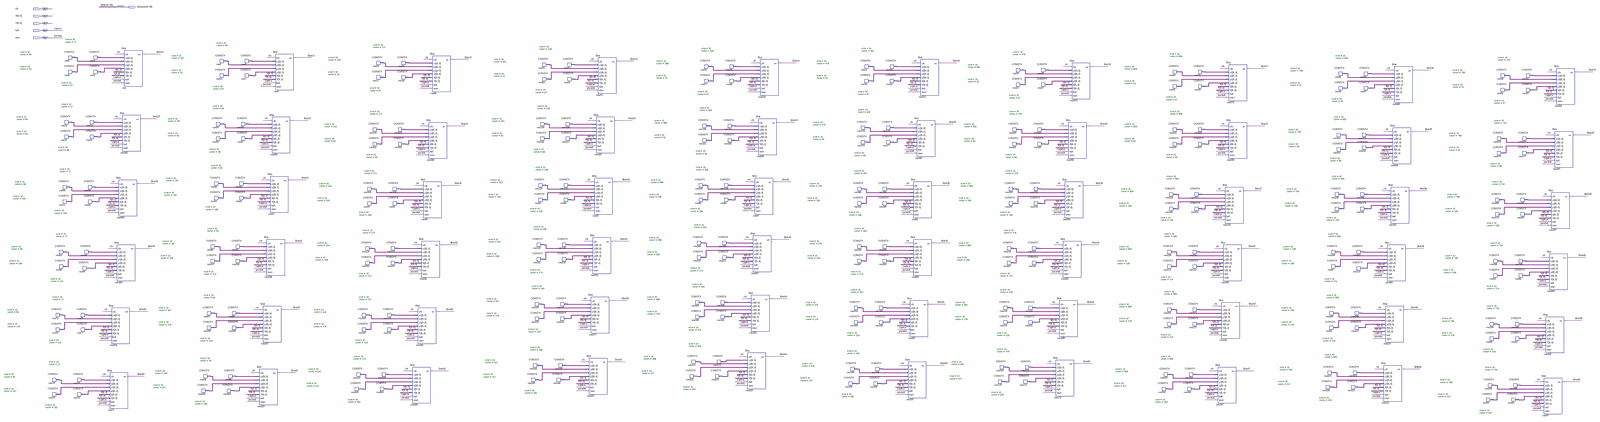
[diagram p0: schematic sheet, whole]
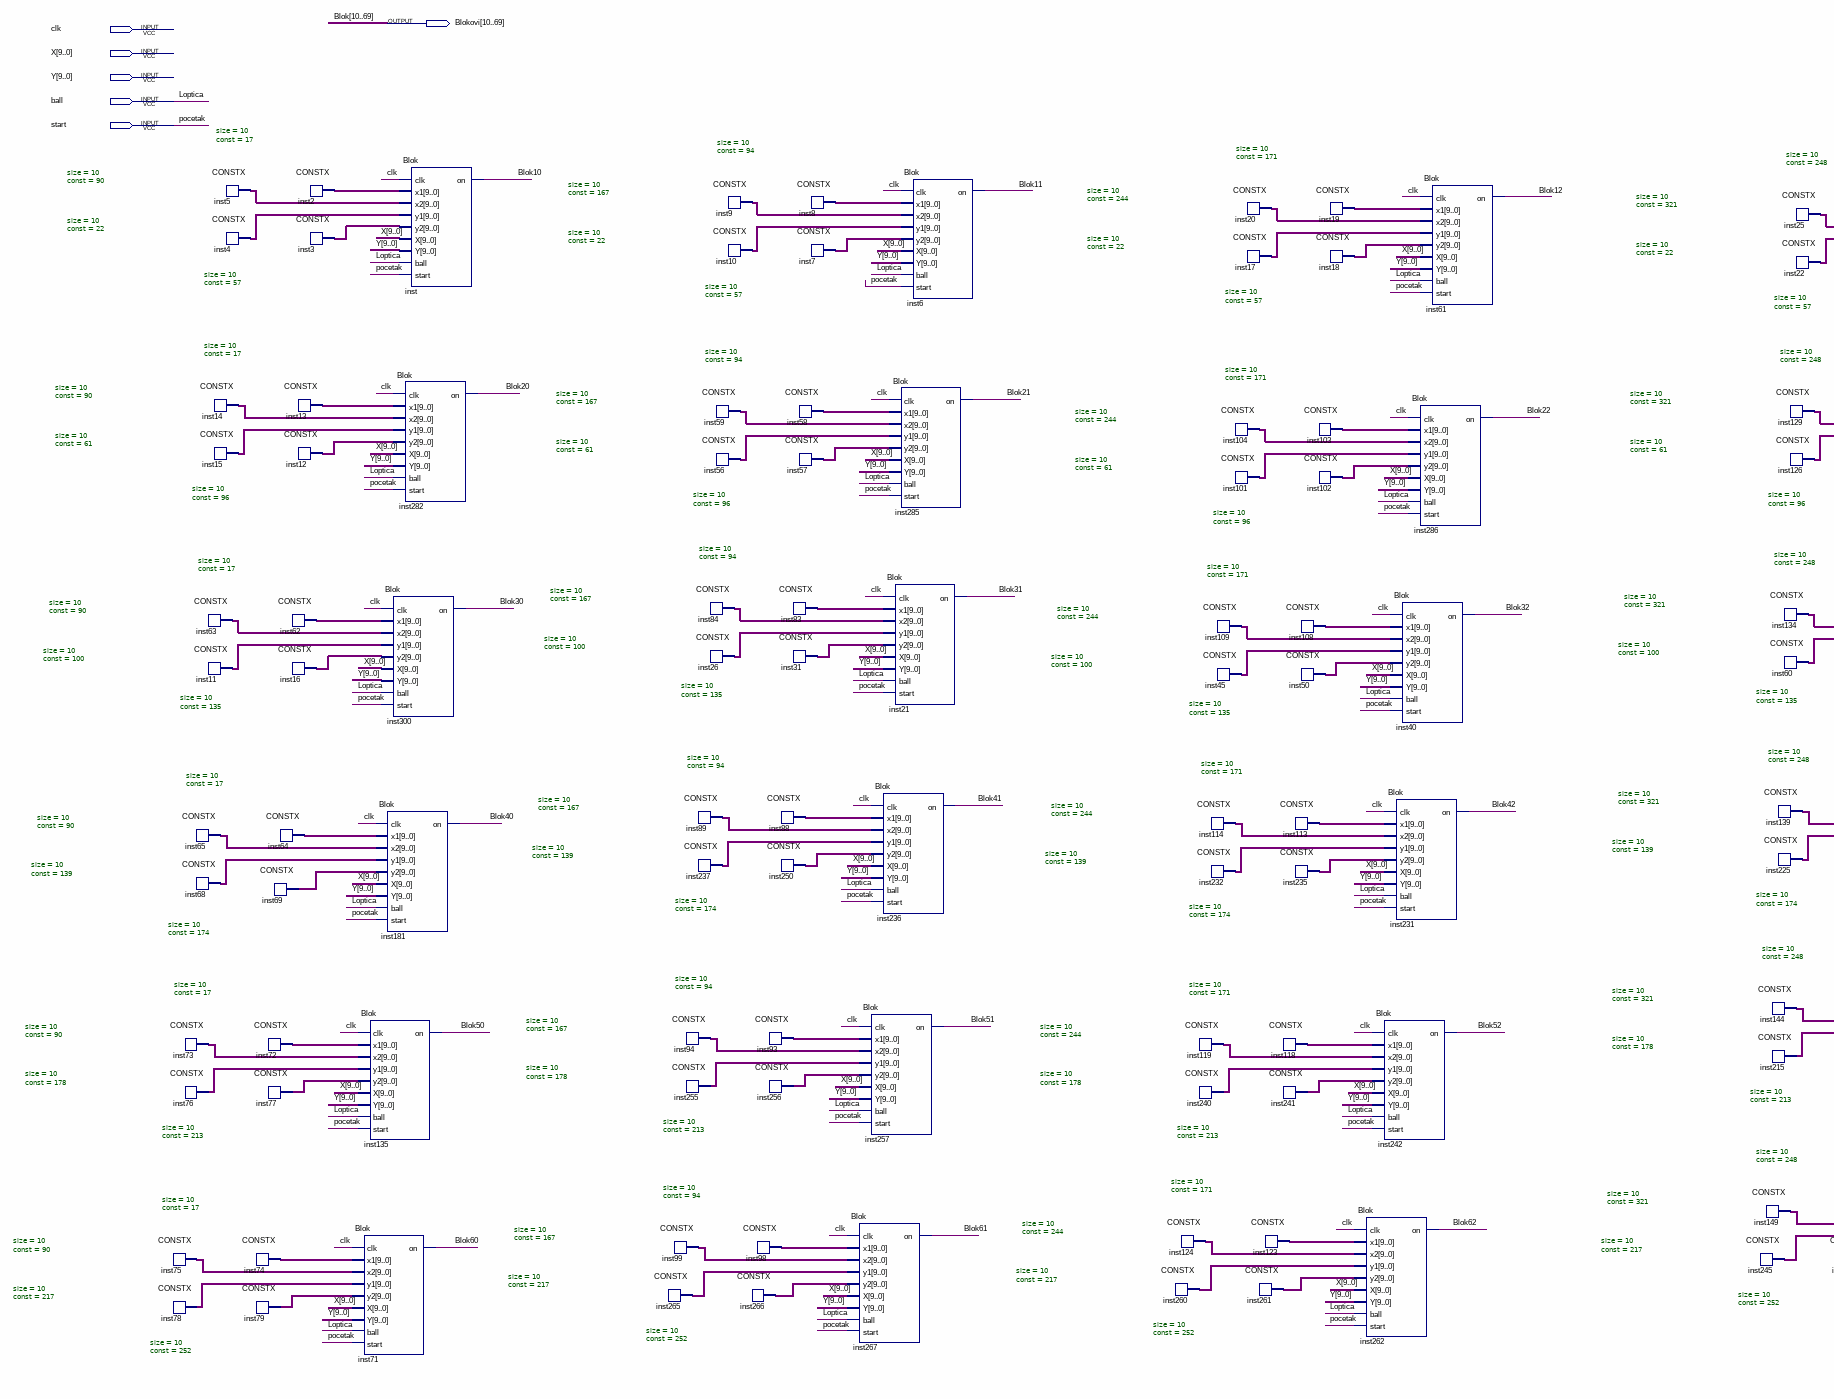
[diagram p1: schematic sheet, left part]
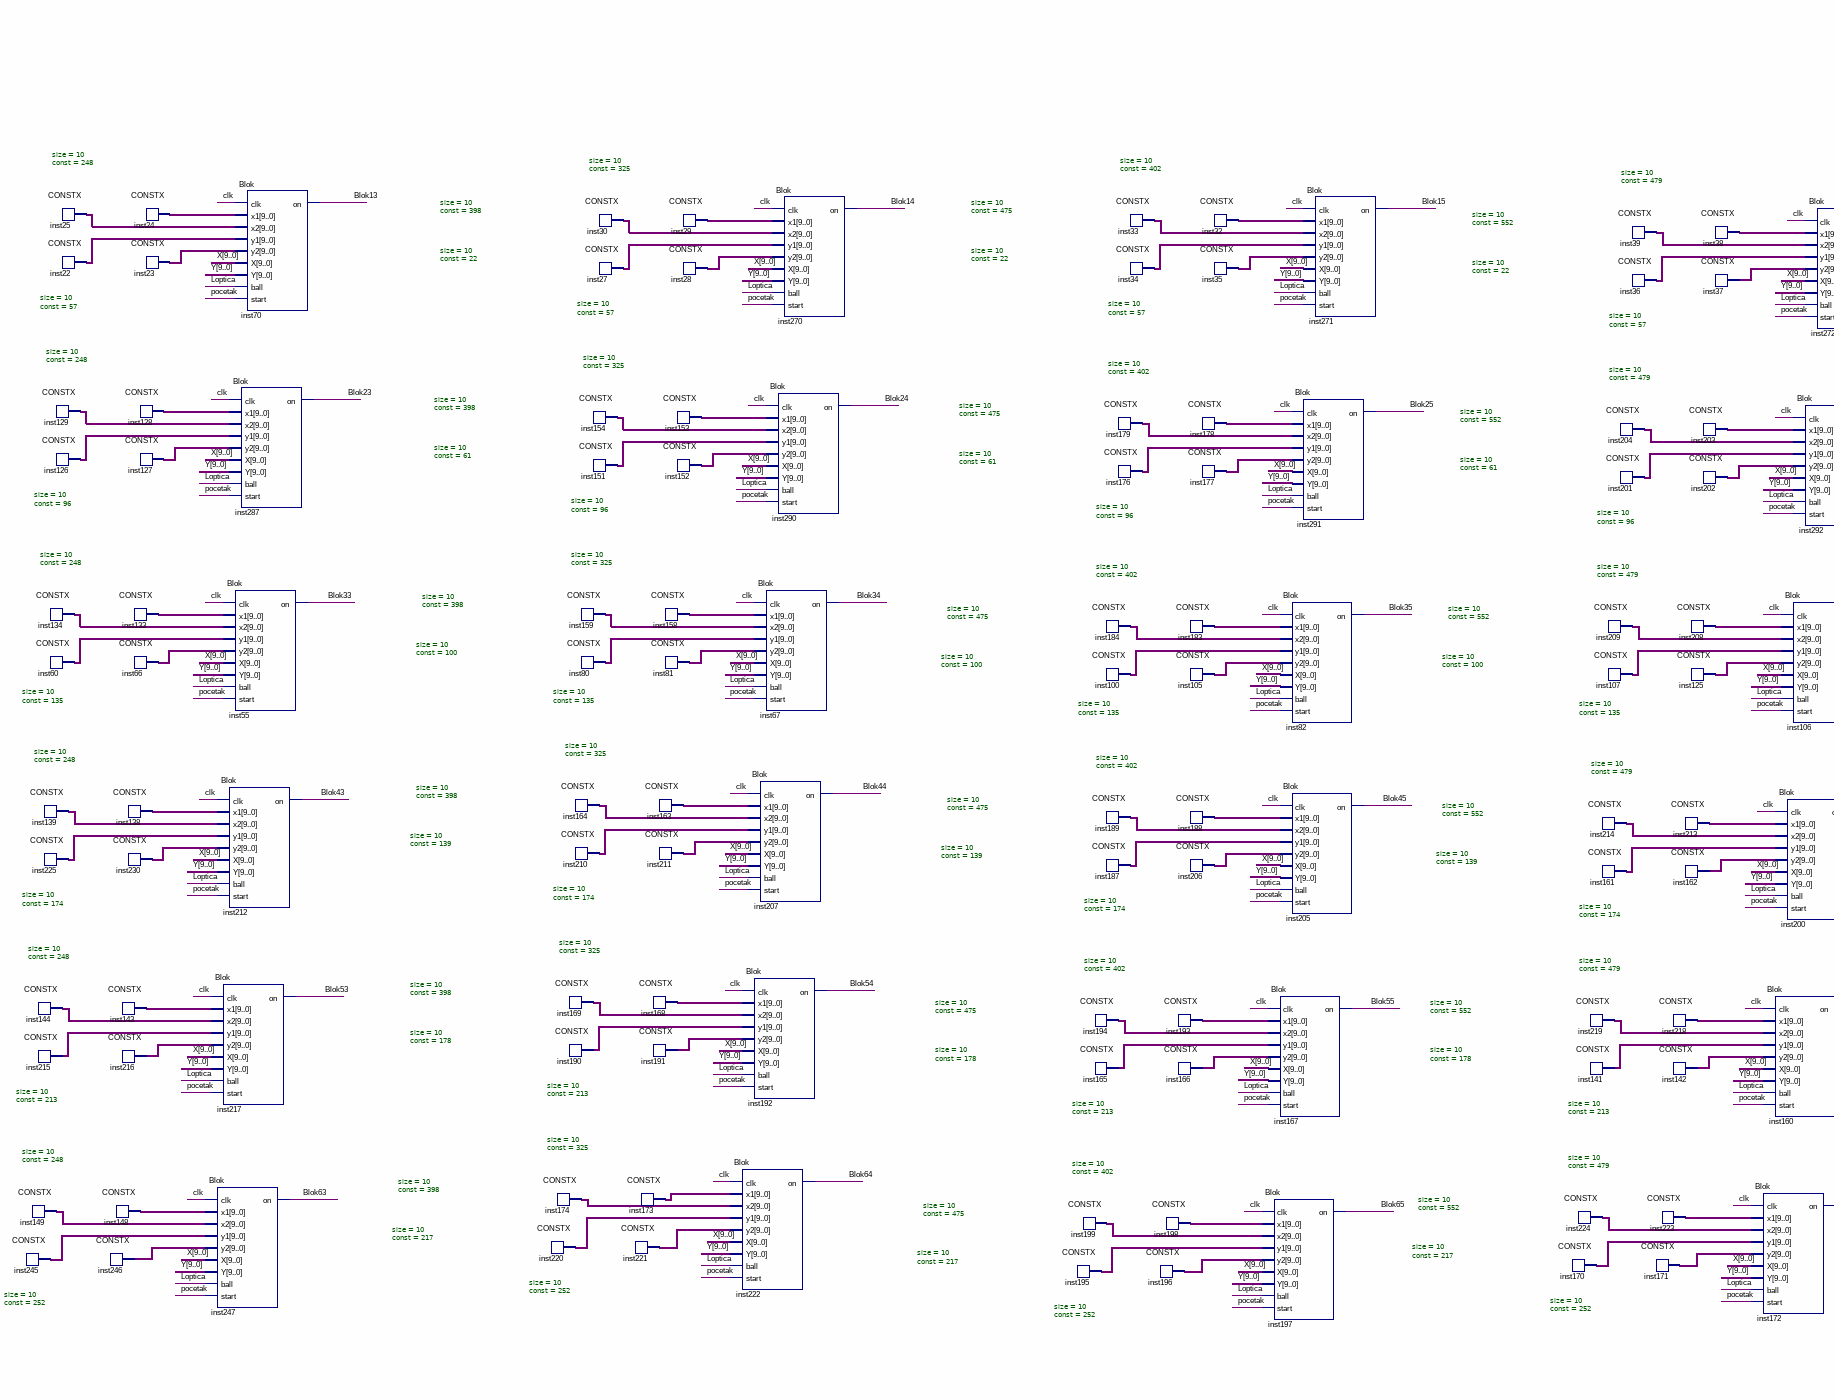
[diagram p2: schematic sheet, centre part]
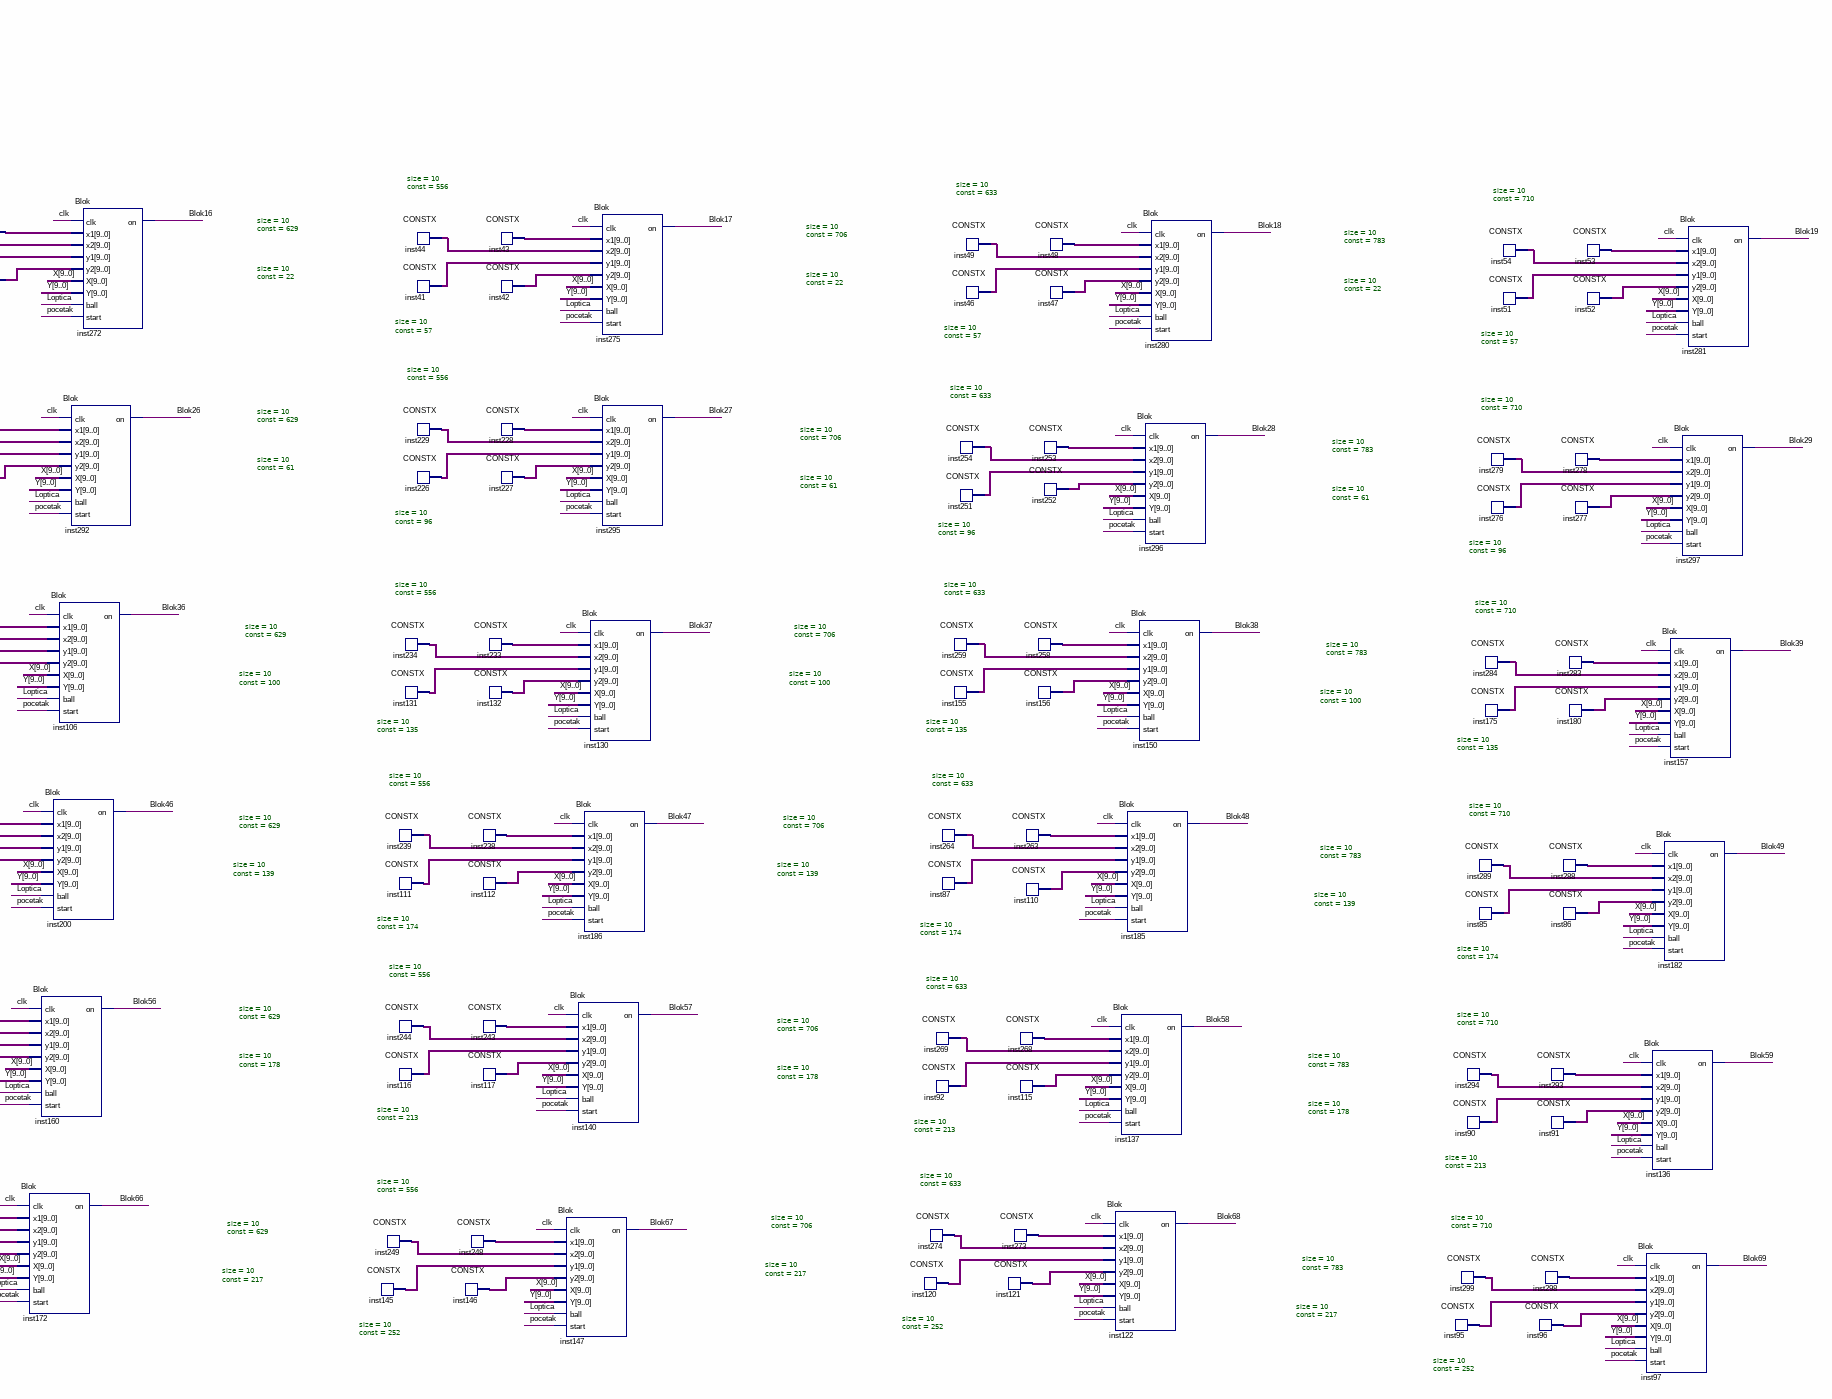
[diagram p3: schematic sheet, right part]
// Quartus schematic Blokovi.bdf as structural Verilog: 300 symbols, 6 pins
module Blokovi (
  input  clk,
  input  [9:0] X,
  input  [9:0] Y,
  input  ball,
  input  start,
  output [10:69] Blokovi
);

  wire [9:0] inst2_data, inst3_data, inst4_data, inst5_data, inst7_data, inst8_data, inst9_data, inst10_data,
       inst11_data, inst12_data, inst13_data, inst14_data, inst15_data, inst16_data, inst17_data,
       inst18_data, inst19_data, inst20_data, inst22_data, inst23_data, inst24_data, inst25_data,
       inst26_data, inst27_data, inst28_data, inst29_data, inst30_data, inst31_data, inst32_data,
       inst33_data, inst34_data, inst35_data, inst36_data, inst37_data, inst38_data, inst39_data,
       inst41_data, inst42_data, inst43_data, inst44_data, inst45_data, inst46_data, inst47_data,
       inst48_data, inst49_data, inst50_data, inst51_data, inst52_data, inst53_data, inst54_data,
       inst56_data, inst57_data, inst58_data, inst59_data, inst60_data, inst62_data, inst63_data,
       inst64_data, inst65_data, inst66_data, inst68_data, inst69_data, inst72_data, inst73_data,
       inst74_data, inst75_data, inst76_data, inst77_data, inst78_data, inst79_data, inst80_data,
       inst81_data, inst83_data, inst84_data, inst85_data, inst86_data, inst87_data, inst88_data,
       inst89_data, inst90_data, inst91_data, inst92_data, inst93_data, inst94_data, inst95_data,
       inst96_data, inst98_data, inst99_data, inst100_data, inst101_data, inst102_data, inst103_data,
       inst104_data, inst105_data, inst107_data, inst108_data, inst109_data, inst110_data, inst111_data,
       inst112_data, inst113_data, inst114_data, inst115_data, inst116_data, inst117_data, inst118_data,
       inst119_data, inst120_data, inst121_data, inst123_data, inst124_data, inst125_data, inst126_data,
       inst127_data, inst128_data, inst129_data, inst131_data, inst132_data, inst133_data, inst134_data,
       inst138_data, inst139_data, inst141_data, inst142_data, inst143_data, inst144_data, inst145_data,
       inst146_data, inst148_data, inst149_data, inst151_data, inst152_data, inst153_data, inst154_data,
       inst155_data, inst156_data, inst158_data, inst159_data, inst161_data, inst162_data, inst163_data,
       inst164_data, inst165_data, inst166_data, inst168_data, inst169_data, inst170_data, inst171_data,
       inst173_data, inst174_data, inst175_data, inst176_data, inst177_data, inst178_data, inst179_data,
       inst180_data, inst183_data, inst184_data, inst187_data, inst188_data, inst189_data, inst190_data,
       inst191_data, inst193_data, inst194_data, inst195_data, inst196_data, inst198_data, inst199_data,
       inst201_data, inst202_data, inst203_data, inst204_data, inst206_data, inst208_data, inst209_data,
       inst210_data, inst211_data, inst213_data, inst214_data, inst215_data, inst216_data, inst218_data,
       inst219_data, inst220_data, inst221_data, inst223_data, inst224_data, inst225_data, inst226_data,
       inst227_data, inst228_data, inst229_data, inst230_data, inst232_data, inst233_data, inst234_data,
       inst235_data, inst237_data, inst238_data, inst239_data, inst240_data, inst241_data, inst243_data,
       inst244_data, inst245_data, inst246_data, inst248_data, inst249_data, inst250_data, inst251_data,
       inst252_data, inst253_data, inst254_data, inst255_data, inst256_data, inst258_data, inst259_data,
       inst260_data, inst261_data, inst263_data, inst264_data, inst265_data, inst266_data, inst268_data,
       inst269_data, inst273_data, inst274_data, inst276_data, inst277_data, inst278_data, inst279_data,
       inst283_data, inst284_data, inst288_data, inst289_data, inst293_data, inst294_data, inst298_data,
       inst299_data;

  CONSTX #(.size(10), .\const (90)) inst65 (.data(inst65_data));
  CONSTX #(.size(10), .\const (139)) inst68 (.data(inst68_data));
  CONSTX #(.size(10), .\const (90)) inst73 (.data(inst73_data));
  CONSTX #(.size(10), .\const (178)) inst76 (.data(inst76_data));
  CONSTX #(.size(10), .\const (90)) inst75 (.data(inst75_data));
  CONSTX #(.size(10), .\const (217)) inst78 (.data(inst78_data));
  CONSTX #(.size(10), .\const (90)) inst5 (.data(inst5_data));
  CONSTX #(.size(10), .\const (22)) inst4 (.data(inst4_data));
  CONSTX #(.size(10), .\const (90)) inst14 (.data(inst14_data));
  CONSTX #(.size(10), .\const (61)) inst15 (.data(inst15_data));
  CONSTX #(.size(10), .\const (90)) inst63 (.data(inst63_data));
  CONSTX #(.size(10), .\const (100)) inst11 (.data(inst11_data));
  CONSTX #(.size(10), .\const (17)) inst13 (.data(inst13_data));
  CONSTX #(.size(10), .\const (96)) inst12 (.data(inst12_data));
  CONSTX #(.size(10), .\const (17)) inst62 (.data(inst62_data));
  CONSTX #(.size(10), .\const (135)) inst16 (.data(inst16_data));
  CONSTX #(.size(10), .\const (17)) inst64 (.data(inst64_data));
  CONSTX #(.size(10), .\const (174)) inst69 (.data(inst69_data));
  CONSTX #(.size(10), .\const (17)) inst72 (.data(inst72_data));
  CONSTX #(.size(10), .\const (213)) inst77 (.data(inst77_data));
  CONSTX #(.size(10), .\const (17)) inst74 (.data(inst74_data));
  CONSTX #(.size(10), .\const (252)) inst79 (.data(inst79_data));
  CONSTX #(.size(10), .\const (17)) inst2 (.data(inst2_data));
  CONSTX #(.size(10), .\const (57)) inst3 (.data(inst3_data));
  Blok inst181 (
    .clk(clk), .x1(inst64_data), .x2(inst65_data), .y1(inst68_data), .y2(inst69_data), .X(X), .Y(Y),
    .ball(ball), .start(start), .on(Blokovi[40]));
  Blok inst135 (
    .clk(clk), .x1(inst72_data), .x2(inst73_data), .y1(inst76_data), .y2(inst77_data), .X(X), .Y(Y),
    .ball(ball), .start(start), .on(Blokovi[50]));
  Blok inst71 (
    .clk(clk), .x1(inst74_data), .x2(inst75_data), .y1(inst78_data), .y2(inst79_data), .X(X), .Y(Y),
    .ball(ball), .start(start), .on(Blokovi[60]));
  Blok inst (
    .clk(clk), .x1(inst2_data), .x2(inst5_data), .y1(inst4_data), .y2(inst3_data), .X(X), .Y(Y), .ball(ball),
    .start(start), .on(Blokovi[10]));
  Blok inst282 (
    .clk(clk), .x1(inst13_data), .x2(inst14_data), .y1(inst15_data), .y2(inst12_data), .X(X), .Y(Y),
    .ball(ball), .start(start), .on(Blokovi[20]));
  Blok inst300 (
    .clk(clk), .x1(inst62_data), .x2(inst63_data), .y1(inst11_data), .y2(inst16_data), .X(X), .Y(Y),
    .ball(ball), .start(start), .on(Blokovi[30]));
  CONSTX #(.size(10), .\const (167)) inst99 (.data(inst99_data));
  CONSTX #(.size(10), .\const (217)) inst265 (.data(inst265_data));
  CONSTX #(.size(10), .\const (167)) inst9 (.data(inst9_data));
  CONSTX #(.size(10), .\const (22)) inst10 (.data(inst10_data));
  CONSTX #(.size(10), .\const (167)) inst59 (.data(inst59_data));
  CONSTX #(.size(10), .\const (61)) inst56 (.data(inst56_data));
  CONSTX #(.size(10), .\const (167)) inst84 (.data(inst84_data));
  CONSTX #(.size(10), .\const (100)) inst26 (.data(inst26_data));
  CONSTX #(.size(10), .\const (167)) inst89 (.data(inst89_data));
  CONSTX #(.size(10), .\const (139)) inst237 (.data(inst237_data));
  CONSTX #(.size(10), .\const (167)) inst94 (.data(inst94_data));
  CONSTX #(.size(10), .\const (178)) inst255 (.data(inst255_data));
  CONSTX #(.size(10), .\const (94)) inst93 (.data(inst93_data));
  CONSTX #(.size(10), .\const (213)) inst256 (.data(inst256_data));
  CONSTX #(.size(10), .\const (94)) inst98 (.data(inst98_data));
  CONSTX #(.size(10), .\const (252)) inst266 (.data(inst266_data));
  CONSTX #(.size(10), .\const (94)) inst8 (.data(inst8_data));
  CONSTX #(.size(10), .\const (57)) inst7 (.data(inst7_data));
  CONSTX #(.size(10), .\const (94)) inst58 (.data(inst58_data));
  CONSTX #(.size(10), .\const (96)) inst57 (.data(inst57_data));
  CONSTX #(.size(10), .\const (94)) inst83 (.data(inst83_data));
  CONSTX #(.size(10), .\const (135)) inst31 (.data(inst31_data));
  CONSTX #(.size(10), .\const (94)) inst88 (.data(inst88_data));
  CONSTX #(.size(10), .\const (174)) inst250 (.data(inst250_data));
  Blok inst267 (
    .clk(clk), .x1(inst98_data), .x2(inst99_data), .y1(inst265_data), .y2(inst266_data), .X(X), .Y(Y),
    .ball(ball), .start(start), .on(Blokovi[61]));
  Blok inst6 (
    .clk(clk), .x1(inst8_data), .x2(inst9_data), .y1(inst10_data), .y2(inst7_data), .X(X), .Y(Y),
    .ball(ball), .start(start), .on(Blokovi[11]));
  Blok inst285 (
    .clk(clk), .x1(inst58_data), .x2(inst59_data), .y1(inst56_data), .y2(inst57_data), .X(X), .Y(Y),
    .ball(ball), .start(start), .on(Blokovi[21]));
  Blok inst21 (
    .clk(clk), .x1(inst83_data), .x2(inst84_data), .y1(inst26_data), .y2(inst31_data), .X(X), .Y(Y),
    .ball(ball), .start(start), .on(Blokovi[31]));
  Blok inst236 (
    .clk(clk), .x1(inst88_data), .x2(inst89_data), .y1(inst237_data), .y2(inst250_data), .X(X), .Y(Y),
    .ball(ball), .start(start), .on(Blokovi[41]));
  Blok inst257 (
    .clk(clk), .x1(inst93_data), .x2(inst94_data), .y1(inst255_data), .y2(inst256_data), .X(X), .Y(Y),
    .ball(ball), .start(start), .on(Blokovi[51]));
  CONSTX #(.size(10), .\const (244)) inst119 (.data(inst119_data));
  CONSTX #(.size(10), .\const (178)) inst240 (.data(inst240_data));
  CONSTX #(.size(10), .\const (244)) inst124 (.data(inst124_data));
  CONSTX #(.size(10), .\const (217)) inst260 (.data(inst260_data));
  CONSTX #(.size(10), .\const (244)) inst20 (.data(inst20_data));
  CONSTX #(.size(10), .\const (22)) inst17 (.data(inst17_data));
  CONSTX #(.size(10), .\const (244)) inst104 (.data(inst104_data));
  CONSTX #(.size(10), .\const (61)) inst101 (.data(inst101_data));
  CONSTX #(.size(10), .\const (244)) inst109 (.data(inst109_data));
  CONSTX #(.size(10), .\const (100)) inst45 (.data(inst45_data));
  CONSTX #(.size(10), .\const (244)) inst114 (.data(inst114_data));
  CONSTX #(.size(10), .\const (139)) inst232 (.data(inst232_data));
  CONSTX #(.size(10), .\const (171)) inst108 (.data(inst108_data));
  CONSTX #(.size(10), .\const (135)) inst50 (.data(inst50_data));
  CONSTX #(.size(10), .\const (171)) inst113 (.data(inst113_data));
  CONSTX #(.size(10), .\const (174)) inst235 (.data(inst235_data));
  CONSTX #(.size(10), .\const (171)) inst118 (.data(inst118_data));
  CONSTX #(.size(10), .\const (213)) inst241 (.data(inst241_data));
  CONSTX #(.size(10), .\const (171)) inst123 (.data(inst123_data));
  CONSTX #(.size(10), .\const (252)) inst261 (.data(inst261_data));
  CONSTX #(.size(10), .\const (171)) inst19 (.data(inst19_data));
  CONSTX #(.size(10), .\const (57)) inst18 (.data(inst18_data));
  CONSTX #(.size(10), .\const (171)) inst103 (.data(inst103_data));
  CONSTX #(.size(10), .\const (96)) inst102 (.data(inst102_data));
  Blok inst242 (
    .clk(clk), .x1(inst118_data), .x2(inst119_data), .y1(inst240_data), .y2(inst241_data), .X(X), .Y(Y),
    .ball(ball), .start(start), .on(Blokovi[52]));
  Blok inst262 (
    .clk(clk), .x1(inst123_data), .x2(inst124_data), .y1(inst260_data), .y2(inst261_data), .X(X), .Y(Y),
    .ball(ball), .start(start), .on(Blokovi[62]));
  Blok inst61 (
    .clk(clk), .x1(inst19_data), .x2(inst20_data), .y1(inst17_data), .y2(inst18_data), .X(X), .Y(Y),
    .ball(ball), .start(start), .on(Blokovi[12]));
  Blok inst286 (
    .clk(clk), .x1(inst103_data), .x2(inst104_data), .y1(inst101_data), .y2(inst102_data), .X(X), .Y(Y),
    .ball(ball), .start(start), .on(Blokovi[22]));
  Blok inst40 (
    .clk(clk), .x1(inst108_data), .x2(inst109_data), .y1(inst45_data), .y2(inst50_data), .X(X), .Y(Y),
    .ball(ball), .start(start), .on(Blokovi[32]));
  Blok inst231 (
    .clk(clk), .x1(inst113_data), .x2(inst114_data), .y1(inst232_data), .y2(inst235_data), .X(X), .Y(Y),
    .ball(ball), .start(start), .on(Blokovi[42]));
  CONSTX #(.size(10), .\const (321)) inst139 (.data(inst139_data));
  CONSTX #(.size(10), .\const (139)) inst225 (.data(inst225_data));
  CONSTX #(.size(10), .\const (321)) inst144 (.data(inst144_data));
  CONSTX #(.size(10), .\const (178)) inst215 (.data(inst215_data));
  CONSTX #(.size(10), .\const (321)) inst149 (.data(inst149_data));
  CONSTX #(.size(10), .\const (217)) inst245 (.data(inst245_data));
  CONSTX #(.size(10), .\const (321)) inst25 (.data(inst25_data));
  CONSTX #(.size(10), .\const (22)) inst22 (.data(inst22_data));
  CONSTX #(.size(10), .\const (321)) inst129 (.data(inst129_data));
  CONSTX #(.size(10), .\const (61)) inst126 (.data(inst126_data));
  CONSTX #(.size(10), .\const (321)) inst134 (.data(inst134_data));
  CONSTX #(.size(10), .\const (100)) inst60 (.data(inst60_data));
  CONSTX #(.size(10), .\const (248)) inst128 (.data(inst128_data));
  CONSTX #(.size(10), .\const (96)) inst127 (.data(inst127_data));
  CONSTX #(.size(10), .\const (248)) inst133 (.data(inst133_data));
  CONSTX #(.size(10), .\const (135)) inst66 (.data(inst66_data));
  CONSTX #(.size(10), .\const (248)) inst138 (.data(inst138_data));
  CONSTX #(.size(10), .\const (174)) inst230 (.data(inst230_data));
  CONSTX #(.size(10), .\const (248)) inst143 (.data(inst143_data));
  CONSTX #(.size(10), .\const (213)) inst216 (.data(inst216_data));
  CONSTX #(.size(10), .\const (248)) inst148 (.data(inst148_data));
  CONSTX #(.size(10), .\const (252)) inst246 (.data(inst246_data));
  CONSTX #(.size(10), .\const (248)) inst24 (.data(inst24_data));
  CONSTX #(.size(10), .\const (57)) inst23 (.data(inst23_data));
  Blok inst212 (
    .clk(clk), .x1(inst138_data), .x2(inst139_data), .y1(inst225_data), .y2(inst230_data), .X(X), .Y(Y),
    .ball(ball), .start(start), .on(Blokovi[43]));
  Blok inst217 (
    .clk(clk), .x1(inst143_data), .x2(inst144_data), .y1(inst215_data), .y2(inst216_data), .X(X), .Y(Y),
    .ball(ball), .start(start), .on(Blokovi[53]));
  Blok inst247 (
    .clk(clk), .x1(inst148_data), .x2(inst149_data), .y1(inst245_data), .y2(inst246_data), .X(X), .Y(Y),
    .ball(ball), .start(start), .on(Blokovi[63]));
  Blok inst70 (
    .clk(clk), .x1(inst24_data), .x2(inst25_data), .y1(inst22_data), .y2(inst23_data), .X(X), .Y(Y),
    .ball(ball), .start(start), .on(Blokovi[13]));
  Blok inst287 (
    .clk(clk), .x1(inst128_data), .x2(inst129_data), .y1(inst126_data), .y2(inst127_data), .X(X), .Y(Y),
    .ball(ball), .start(start), .on(Blokovi[23]));
  Blok inst55 (
    .clk(clk), .x1(inst133_data), .x2(inst134_data), .y1(inst60_data), .y2(inst66_data), .X(X), .Y(Y),
    .ball(ball), .start(start), .on(Blokovi[33]));
  CONSTX #(.size(10), .\const (398)) inst169 (.data(inst169_data));
  CONSTX #(.size(10), .\const (178)) inst190 (.data(inst190_data));
  CONSTX #(.size(10), .\const (398)) inst174 (.data(inst174_data));
  CONSTX #(.size(10), .\const (217)) inst220 (.data(inst220_data));
  CONSTX #(.size(10), .\const (398)) inst30 (.data(inst30_data));
  CONSTX #(.size(10), .\const (22)) inst27 (.data(inst27_data));
  CONSTX #(.size(10), .\const (398)) inst154 (.data(inst154_data));
  CONSTX #(.size(10), .\const (61)) inst151 (.data(inst151_data));
  CONSTX #(.size(10), .\const (398)) inst159 (.data(inst159_data));
  CONSTX #(.size(10), .\const (100)) inst80 (.data(inst80_data));
  CONSTX #(.size(10), .\const (398)) inst164 (.data(inst164_data));
  CONSTX #(.size(10), .\const (139)) inst210 (.data(inst210_data));
  CONSTX #(.size(10), .\const (325)) inst158 (.data(inst158_data));
  CONSTX #(.size(10), .\const (135)) inst81 (.data(inst81_data));
  CONSTX #(.size(10), .\const (325)) inst163 (.data(inst163_data));
  CONSTX #(.size(10), .\const (174)) inst211 (.data(inst211_data));
  CONSTX #(.size(10), .\const (325)) inst168 (.data(inst168_data));
  CONSTX #(.size(10), .\const (213)) inst191 (.data(inst191_data));
  CONSTX #(.size(10), .\const (325)) inst173 (.data(inst173_data));
  CONSTX #(.size(10), .\const (252)) inst221 (.data(inst221_data));
  CONSTX #(.size(10), .\const (325)) inst29 (.data(inst29_data));
  CONSTX #(.size(10), .\const (57)) inst28 (.data(inst28_data));
  CONSTX #(.size(10), .\const (325)) inst153 (.data(inst153_data));
  CONSTX #(.size(10), .\const (96)) inst152 (.data(inst152_data));
  Blok inst192 (
    .clk(clk), .x1(inst168_data), .x2(inst169_data), .y1(inst190_data), .y2(inst191_data), .X(X), .Y(Y),
    .ball(ball), .start(start), .on(Blokovi[54]));
  Blok inst222 (
    .clk(clk), .x1(inst173_data), .x2(inst174_data), .y1(inst220_data), .y2(inst221_data), .X(X), .Y(Y),
    .ball(ball), .start(start), .on(Blokovi[64]));
  Blok inst270 (
    .clk(clk), .x1(inst29_data), .x2(inst30_data), .y1(inst27_data), .y2(inst28_data), .X(X), .Y(Y),
    .ball(ball), .start(start), .on(Blokovi[14]));
  Blok inst290 (
    .clk(clk), .x1(inst153_data), .x2(inst154_data), .y1(inst151_data), .y2(inst152_data), .X(X), .Y(Y),
    .ball(ball), .start(start), .on(Blokovi[24]));
  Blok inst67 (
    .clk(clk), .x1(inst158_data), .x2(inst159_data), .y1(inst80_data), .y2(inst81_data), .X(X), .Y(Y),
    .ball(ball), .start(start), .on(Blokovi[34]));
  Blok inst207 (
    .clk(clk), .x1(inst163_data), .x2(inst164_data), .y1(inst210_data), .y2(inst211_data), .X(X), .Y(Y),
    .ball(ball), .start(start), .on(Blokovi[44]));
  CONSTX #(.size(10), .\const (475)) inst194 (.data(inst194_data));
  CONSTX #(.size(10), .\const (178)) inst165 (.data(inst165_data));
  CONSTX #(.size(10), .\const (475)) inst199 (.data(inst199_data));
  CONSTX #(.size(10), .\const (217)) inst195 (.data(inst195_data));
  CONSTX #(.size(10), .\const (475)) inst33 (.data(inst33_data));
  CONSTX #(.size(10), .\const (22)) inst34 (.data(inst34_data));
  CONSTX #(.size(10), .\const (475)) inst179 (.data(inst179_data));
  CONSTX #(.size(10), .\const (61)) inst176 (.data(inst176_data));
  CONSTX #(.size(10), .\const (475)) inst184 (.data(inst184_data));
  CONSTX #(.size(10), .\const (100)) inst100 (.data(inst100_data));
  CONSTX #(.size(10), .\const (475)) inst189 (.data(inst189_data));
  CONSTX #(.size(10), .\const (139)) inst187 (.data(inst187_data));
  CONSTX #(.size(10), .\const (402)) inst183 (.data(inst183_data));
  CONSTX #(.size(10), .\const (135)) inst105 (.data(inst105_data));
  CONSTX #(.size(10), .\const (402)) inst188 (.data(inst188_data));
  CONSTX #(.size(10), .\const (174)) inst206 (.data(inst206_data));
  CONSTX #(.size(10), .\const (402)) inst193 (.data(inst193_data));
  CONSTX #(.size(10), .\const (213)) inst166 (.data(inst166_data));
  CONSTX #(.size(10), .\const (402)) inst198 (.data(inst198_data));
  CONSTX #(.size(10), .\const (252)) inst196 (.data(inst196_data));
  CONSTX #(.size(10), .\const (402)) inst32 (.data(inst32_data));
  CONSTX #(.size(10), .\const (57)) inst35 (.data(inst35_data));
  CONSTX #(.size(10), .\const (402)) inst178 (.data(inst178_data));
  CONSTX #(.size(10), .\const (96)) inst177 (.data(inst177_data));
  Blok inst167 (
    .clk(clk), .x1(inst193_data), .x2(inst194_data), .y1(inst165_data), .y2(inst166_data), .X(X), .Y(Y),
    .ball(ball), .start(start), .on(Blokovi[55]));
  Blok inst197 (
    .clk(clk), .x1(inst198_data), .x2(inst199_data), .y1(inst195_data), .y2(inst196_data), .X(X), .Y(Y),
    .ball(ball), .start(start), .on(Blokovi[65]));
  Blok inst271 (
    .clk(clk), .x1(inst32_data), .x2(inst33_data), .y1(inst34_data), .y2(inst35_data), .X(X), .Y(Y),
    .ball(ball), .start(start), .on(Blokovi[15]));
  Blok inst291 (
    .clk(clk), .x1(inst178_data), .x2(inst179_data), .y1(inst176_data), .y2(inst177_data), .X(X), .Y(Y),
    .ball(ball), .start(start), .on(Blokovi[25]));
  Blok inst82 (
    .clk(clk), .x1(inst183_data), .x2(inst184_data), .y1(inst100_data), .y2(inst105_data), .X(X), .Y(Y),
    .ball(ball), .start(start), .on(Blokovi[35]));
  Blok inst205 (
    .clk(clk), .x1(inst188_data), .x2(inst189_data), .y1(inst187_data), .y2(inst206_data), .X(X), .Y(Y),
    .ball(ball), .start(start), .on(Blokovi[45]));
  CONSTX #(.size(10), .\const (217)) inst170 (.data(inst170_data));
  CONSTX #(.size(10), .\const (552)) inst204 (.data(inst204_data));
  CONSTX #(.size(10), .\const (61)) inst201 (.data(inst201_data));
  CONSTX #(.size(10), .\const (552)) inst209 (.data(inst209_data));
  CONSTX #(.size(10), .\const (100)) inst107 (.data(inst107_data));
  CONSTX #(.size(10), .\const (552)) inst214 (.data(inst214_data));
  CONSTX #(.size(10), .\const (139)) inst161 (.data(inst161_data));
  CONSTX #(.size(10), .\const (552)) inst219 (.data(inst219_data));
  CONSTX #(.size(10), .\const (178)) inst141 (.data(inst141_data));
  CONSTX #(.size(10), .\const (552)) inst224 (.data(inst224_data));
  CONSTX #(.size(10), .\const (552)) inst39 (.data(inst39_data));
  CONSTX #(.size(10), .\const (22)) inst36 (.data(inst36_data));
  CONSTX #(.size(10), .\const (479)) inst223 (.data(inst223_data));
  CONSTX #(.size(10), .\const (252)) inst171 (.data(inst171_data));
  CONSTX #(.size(10), .\const (479)) inst38 (.data(inst38_data));
  CONSTX #(.size(10), .\const (57)) inst37 (.data(inst37_data));
  CONSTX #(.size(10), .\const (479)) inst203 (.data(inst203_data));
  CONSTX #(.size(10), .\const (96)) inst202 (.data(inst202_data));
  CONSTX #(.size(10), .\const (479)) inst208 (.data(inst208_data));
  CONSTX #(.size(10), .\const (135)) inst125 (.data(inst125_data));
  CONSTX #(.size(10), .\const (479)) inst213 (.data(inst213_data));
  CONSTX #(.size(10), .\const (174)) inst162 (.data(inst162_data));
  CONSTX #(.size(10), .\const (479)) inst218 (.data(inst218_data));
  CONSTX #(.size(10), .\const (213)) inst142 (.data(inst142_data));
  Blok inst292 (
    .clk(clk), .x1(inst203_data), .x2(inst204_data), .y1(inst201_data), .y2(inst202_data), .X(X), .Y(Y),
    .ball(ball), .start(start), .on(Blokovi[26]));
  Blok inst106 (
    .clk(clk), .x1(inst208_data), .x2(inst209_data), .y1(inst107_data), .y2(inst125_data), .X(X), .Y(Y),
    .ball(ball), .start(start), .on(Blokovi[36]));
  Blok inst200 (
    .clk(clk), .x1(inst213_data), .x2(inst214_data), .y1(inst161_data), .y2(inst162_data), .X(X), .Y(Y),
    .ball(ball), .start(start), .on(Blokovi[46]));
  Blok inst160 (
    .clk(clk), .x1(inst218_data), .x2(inst219_data), .y1(inst141_data), .y2(inst142_data), .X(X), .Y(Y),
    .ball(ball), .start(start), .on(Blokovi[56]));
  Blok inst172 (
    .clk(clk), .x1(inst223_data), .x2(inst224_data), .y1(inst170_data), .y2(inst171_data), .X(X), .Y(Y),
    .ball(ball), .start(start), .on(Blokovi[66]));
  Blok inst272 (
    .clk(clk), .x1(inst38_data), .x2(inst39_data), .y1(inst36_data), .y2(inst37_data), .X(X), .Y(Y),
    .ball(ball), .start(start), .on(Blokovi[16]));
  CONSTX #(.size(10), .\const (629)) inst234 (.data(inst234_data));
  CONSTX #(.size(10), .\const (100)) inst131 (.data(inst131_data));
  CONSTX #(.size(10), .\const (629)) inst239 (.data(inst239_data));
  CONSTX #(.size(10), .\const (139)) inst111 (.data(inst111_data));
  CONSTX #(.size(10), .\const (629)) inst244 (.data(inst244_data));
  CONSTX #(.size(10), .\const (178)) inst116 (.data(inst116_data));
  CONSTX #(.size(10), .\const (629)) inst249 (.data(inst249_data));
  CONSTX #(.size(10), .\const (217)) inst145 (.data(inst145_data));
  CONSTX #(.size(10), .\const (629)) inst44 (.data(inst44_data));
  CONSTX #(.size(10), .\const (22)) inst41 (.data(inst41_data));
  CONSTX #(.size(10), .\const (629)) inst229 (.data(inst229_data));
  CONSTX #(.size(10), .\const (61)) inst226 (.data(inst226_data));
  CONSTX #(.size(10), .\const (556)) inst43 (.data(inst43_data));
  CONSTX #(.size(10), .\const (57)) inst42 (.data(inst42_data));
  CONSTX #(.size(10), .\const (556)) inst228 (.data(inst228_data));
  CONSTX #(.size(10), .\const (96)) inst227 (.data(inst227_data));
  CONSTX #(.size(10), .\const (556)) inst233 (.data(inst233_data));
  CONSTX #(.size(10), .\const (135)) inst132 (.data(inst132_data));
  CONSTX #(.size(10), .\const (556)) inst238 (.data(inst238_data));
  CONSTX #(.size(10), .\const (174)) inst112 (.data(inst112_data));
  CONSTX #(.size(10), .\const (556)) inst243 (.data(inst243_data));
  CONSTX #(.size(10), .\const (213)) inst117 (.data(inst117_data));
  CONSTX #(.size(10), .\const (556)) inst248 (.data(inst248_data));
  CONSTX #(.size(10), .\const (252)) inst146 (.data(inst146_data));
  Blok inst130 (
    .clk(clk), .x1(inst233_data), .x2(inst234_data), .y1(inst131_data), .y2(inst132_data), .X(X), .Y(Y),
    .ball(ball), .start(start), .on(Blokovi[37]));
  Blok inst186 (
    .clk(clk), .x1(inst238_data), .x2(inst239_data), .y1(inst111_data), .y2(inst112_data), .X(X), .Y(Y),
    .ball(ball), .start(start), .on(Blokovi[47]));
  Blok inst140 (
    .clk(clk), .x1(inst243_data), .x2(inst244_data), .y1(inst116_data), .y2(inst117_data), .X(X), .Y(Y),
    .ball(ball), .start(start), .on(Blokovi[57]));
  Blok inst147 (
    .clk(clk), .x1(inst248_data), .x2(inst249_data), .y1(inst145_data), .y2(inst146_data), .X(X), .Y(Y),
    .ball(ball), .start(start), .on(Blokovi[67]));
  Blok inst275 (
    .clk(clk), .x1(inst43_data), .x2(inst44_data), .y1(inst41_data), .y2(inst42_data), .X(X), .Y(Y),
    .ball(ball), .start(start), .on(Blokovi[17]));
  Blok inst295 (
    .clk(clk), .x1(inst228_data), .x2(inst229_data), .y1(inst226_data), .y2(inst227_data), .X(X), .Y(Y),
    .ball(ball), .start(start), .on(Blokovi[27]));
  CONSTX #(.size(10), .\const (706)) inst269 (.data(inst269_data));
  CONSTX #(.size(10), .\const (178)) inst92 (.data(inst92_data));
  CONSTX #(.size(10), .\const (706)) inst274 (.data(inst274_data));
  CONSTX #(.size(10), .\const (217)) inst120 (.data(inst120_data));
  CONSTX #(.size(10), .\const (706)) inst49 (.data(inst49_data));
  CONSTX #(.size(10), .\const (22)) inst46 (.data(inst46_data));
  CONSTX #(.size(10), .\const (706)) inst254 (.data(inst254_data));
  CONSTX #(.size(10), .\const (61)) inst251 (.data(inst251_data));
  CONSTX #(.size(10), .\const (706)) inst259 (.data(inst259_data));
  CONSTX #(.size(10), .\const (100)) inst155 (.data(inst155_data));
  CONSTX #(.size(10), .\const (706)) inst264 (.data(inst264_data));
  CONSTX #(.size(10), .\const (139)) inst87 (.data(inst87_data));
  CONSTX #(.size(10), .\const (633)) inst263 (.data(inst263_data));
  CONSTX #(.size(10), .\const (174)) inst110 (.data(inst110_data));
  CONSTX #(.size(10), .\const (633)) inst268 (.data(inst268_data));
  CONSTX #(.size(10), .\const (213)) inst115 (.data(inst115_data));
  CONSTX #(.size(10), .\const (633)) inst273 (.data(inst273_data));
  CONSTX #(.size(10), .\const (252)) inst121 (.data(inst121_data));
  CONSTX #(.size(10), .\const (633)) inst48 (.data(inst48_data));
  CONSTX #(.size(10), .\const (57)) inst47 (.data(inst47_data));
  CONSTX #(.size(10), .\const (633)) inst253 (.data(inst253_data));
  CONSTX #(.size(10), .\const (96)) inst252 (.data(inst252_data));
  CONSTX #(.size(10), .\const (633)) inst258 (.data(inst258_data));
  CONSTX #(.size(10), .\const (135)) inst156 (.data(inst156_data));
  Blok inst137 (
    .clk(clk), .x1(inst268_data), .x2(inst269_data), .y1(inst92_data), .y2(inst115_data), .X(X), .Y(Y),
    .ball(ball), .start(start), .on(Blokovi[58]));
  Blok inst122 (
    .clk(clk), .x1(inst273_data), .x2(inst274_data), .y1(inst120_data), .y2(inst121_data), .X(X), .Y(Y),
    .ball(ball), .start(start), .on(Blokovi[68]));
  Blok inst280 (
    .clk(clk), .x1(inst48_data), .x2(inst49_data), .y1(inst46_data), .y2(inst47_data), .X(X), .Y(Y),
    .ball(ball), .start(start), .on(Blokovi[18]));
  Blok inst296 (
    .clk(clk), .x1(inst253_data), .x2(inst254_data), .y1(inst251_data), .y2(inst252_data), .X(X), .Y(Y),
    .ball(ball), .start(start), .on(Blokovi[28]));
  Blok inst150 (
    .clk(clk), .x1(inst258_data), .x2(inst259_data), .y1(inst155_data), .y2(inst156_data), .X(X), .Y(Y),
    .ball(ball), .start(start), .on(Blokovi[38]));
  Blok inst185 (
    .clk(clk), .x1(inst263_data), .x2(inst264_data), .y1(inst87_data), .y2(inst110_data), .X(X), .Y(Y),
    .ball(ball), .start(start), .on(Blokovi[48]));
  CONSTX #(.size(10), .\const (783)) inst299 (.data(inst299_data));
  CONSTX #(.size(10), .\const (217)) inst95 (.data(inst95_data));
  CONSTX #(.size(10), .\const (783)) inst54 (.data(inst54_data));
  CONSTX #(.size(10), .\const (22)) inst51 (.data(inst51_data));
  CONSTX #(.size(10), .\const (783)) inst279 (.data(inst279_data));
  CONSTX #(.size(10), .\const (61)) inst276 (.data(inst276_data));
  CONSTX #(.size(10), .\const (783)) inst284 (.data(inst284_data));
  CONSTX #(.size(10), .\const (100)) inst175 (.data(inst175_data));
  CONSTX #(.size(10), .\const (783)) inst289 (.data(inst289_data));
  CONSTX #(.size(10), .\const (139)) inst85 (.data(inst85_data));
  CONSTX #(.size(10), .\const (783)) inst294 (.data(inst294_data));
  CONSTX #(.size(10), .\const (178)) inst90 (.data(inst90_data));
  CONSTX #(.size(10), .\const (710)) inst293 (.data(inst293_data));
  CONSTX #(.size(10), .\const (213)) inst91 (.data(inst91_data));
  CONSTX #(.size(10), .\const (710)) inst298 (.data(inst298_data));
  CONSTX #(.size(10), .\const (252)) inst96 (.data(inst96_data));
  CONSTX #(.size(10), .\const (710)) inst53 (.data(inst53_data));
  CONSTX #(.size(10), .\const (57)) inst52 (.data(inst52_data));
  CONSTX #(.size(10), .\const (710)) inst278 (.data(inst278_data));
  CONSTX #(.size(10), .\const (96)) inst277 (.data(inst277_data));
  CONSTX #(.size(10), .\const (710)) inst283 (.data(inst283_data));
  CONSTX #(.size(10), .\const (135)) inst180 (.data(inst180_data));
  CONSTX #(.size(10), .\const (710)) inst288 (.data(inst288_data));
  CONSTX #(.size(10), .\const (174)) inst86 (.data(inst86_data));
  Blok inst97 (
    .clk(clk), .x1(inst298_data), .x2(inst299_data), .y1(inst95_data), .y2(inst96_data), .X(X), .Y(Y),
    .ball(ball), .start(start), .on(Blokovi[69]));
  Blok inst281 (
    .clk(clk), .x1(inst53_data), .x2(inst54_data), .y1(inst51_data), .y2(inst52_data), .X(X), .Y(Y),
    .ball(ball), .start(start), .on(Blokovi[19]));
  Blok inst297 (
    .clk(clk), .x1(inst278_data), .x2(inst279_data), .y1(inst276_data), .y2(inst277_data), .X(X), .Y(Y),
    .ball(ball), .start(start), .on(Blokovi[29]));
  Blok inst157 (
    .clk(clk), .x1(inst283_data), .x2(inst284_data), .y1(inst175_data), .y2(inst180_data), .X(X), .Y(Y),
    .ball(ball), .start(start), .on(Blokovi[39]));
  Blok inst182 (
    .clk(clk), .x1(inst288_data), .x2(inst289_data), .y1(inst85_data), .y2(inst86_data), .X(X), .Y(Y),
    .ball(ball), .start(start), .on(Blokovi[49]));
  Blok inst136 (
    .clk(clk), .x1(inst293_data), .x2(inst294_data), .y1(inst90_data), .y2(inst91_data), .X(X), .Y(Y),
    .ball(ball), .start(start), .on(Blokovi[59]));

  // Other names for the same wires on the sheet: Blok[69:10] = {Blokovi[69], Blokovi[68], Blokovi[67], Blokovi[66], Blokovi[65], Blokovi[64], Blokovi[63], Blokovi[62], Blokovi[61], Blokovi[60], Blokovi[59], Blokovi[58], Blokovi[57], Blokovi[56], Blokovi[55], Blokovi[54], Blokovi[53], Blokovi[52], Blokovi[51], Blokovi[50], Blokovi[49], Blokovi[48], Blokovi[47], Blokovi[46], Blokovi[45], Blokovi[44], Blokovi[43], Blokovi[42], Blokovi[41], Blokovi[40], Blokovi[39], Blokovi[38], Blokovi[37], Blokovi[36], Blokovi[35], Blokovi[34], Blokovi[33], Blokovi[32], Blokovi[31], Blokovi[30], Blokovi[29], Blokovi[28], Blokovi[27], Blokovi[26], Blokovi[25], Blokovi[24], Blokovi[23], Blokovi[22], Blokovi[21], Blokovi[20], Blokovi[19], Blokovi[18], Blokovi[17], Blokovi[16], Blokovi[15], Blokovi[14], Blokovi[13], Blokovi[12], Blokovi[11], Blokovi[10]};
  //   Blok10 = Blokovi[10]; Blok11 = Blokovi[11]; Blok12 = Blokovi[12]; Blok13 = Blokovi[13]; Blok14 = Blokovi[14];
  //   Blok15 = Blokovi[15]; Blok16 = Blokovi[16]; Blok17 = Blokovi[17]; Blok18 = Blokovi[18]; Blok19 = Blokovi[19];
  //   Blok20 = Blokovi[20]; Blok21 = Blokovi[21]; Blok22 = Blokovi[22]; Blok23 = Blokovi[23]; Blok24 = Blokovi[24];
  //   Blok25 = Blokovi[25]; Blok26 = Blokovi[26]; Blok27 = Blokovi[27]; Blok28 = Blokovi[28]; Blok29 = Blokovi[29];
  //   Blok30 = Blokovi[30]; Blok31 = Blokovi[31]; Blok32 = Blokovi[32]; Blok33 = Blokovi[33]; Blok34 = Blokovi[34];
  //   Blok35 = Blokovi[35]; Blok36 = Blokovi[36]; Blok37 = Blokovi[37]; Blok38 = Blokovi[38]; Blok39 = Blokovi[39];
  //   Blok40 = Blokovi[40]; Blok41 = Blokovi[41]; Blok42 = Blokovi[42]; Blok43 = Blokovi[43]; Blok44 = Blokovi[44];
  //   Blok45 = Blokovi[45]; Blok46 = Blokovi[46]; Blok47 = Blokovi[47]; Blok48 = Blokovi[48]; Blok49 = Blokovi[49];
  //   Blok50 = Blokovi[50]; Blok51 = Blokovi[51]; Blok52 = Blokovi[52]; Blok53 = Blokovi[53]; Blok54 = Blokovi[54];
  //   Blok55 = Blokovi[55]; Blok56 = Blokovi[56]; Blok57 = Blokovi[57]; Blok58 = Blokovi[58]; Blok59 = Blokovi[59];
  //   Blok60 = Blokovi[60]; Blok61 = Blokovi[61]; Blok62 = Blokovi[62]; Blok63 = Blokovi[63]; Blok64 = Blokovi[64];
  //   Blok65 = Blokovi[65]; Blok66 = Blokovi[66]; Blok67 = Blokovi[67]; Blok68 = Blokovi[68]; Blok69 = Blokovi[69];
  //   Loptica = ball; pocetak = start
endmodule
